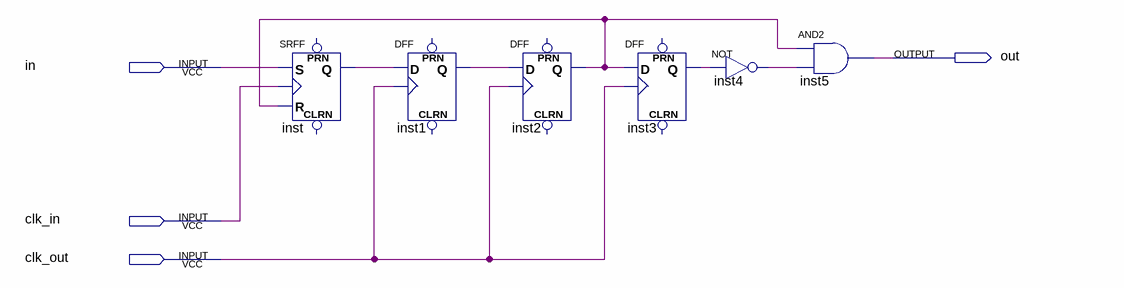
[diagram p0: schematic sheet]
// Quartus schematic cdc1.bdf as structural Verilog: 6 symbols, 4 pins
module cdc1 (
  input  in,
  input  clk_in,
  input  clk_out,
  output out
);

  wire inst1_q, inst2_q, inst3_q, inst4_out, inst_q;

  SRFF inst (.S(in), .R(inst2_q), .CLK(clk_in), .Q(inst_q));  // open: PRN, CLRN
  DFF inst1 (.CLK(clk_out), .D(inst_q), .Q(inst1_q));  // open: CLRN, PRN
  DFF inst2 (.CLK(clk_out), .D(inst1_q), .Q(inst2_q));  // open: CLRN, PRN
  DFF inst3 (.CLK(clk_out), .D(inst2_q), .Q(inst3_q));  // open: CLRN, PRN
  not inst4 (inst4_out, inst3_q);
  and inst5 (out, inst2_q, inst4_out);
endmodule
